# Altium schematic sheet Project_Information.SchDoc: =project_title
size Tabloid; CompanyName: Luxonis Holding; Organization: Luxonis Holding; Address1: 1925 Harmony Park Drive; Address2: Westminster, CO; Address3: 80234; Address4: United States; DocumentNumber: 1; SheetNumber: 1; SheetTotal: 2
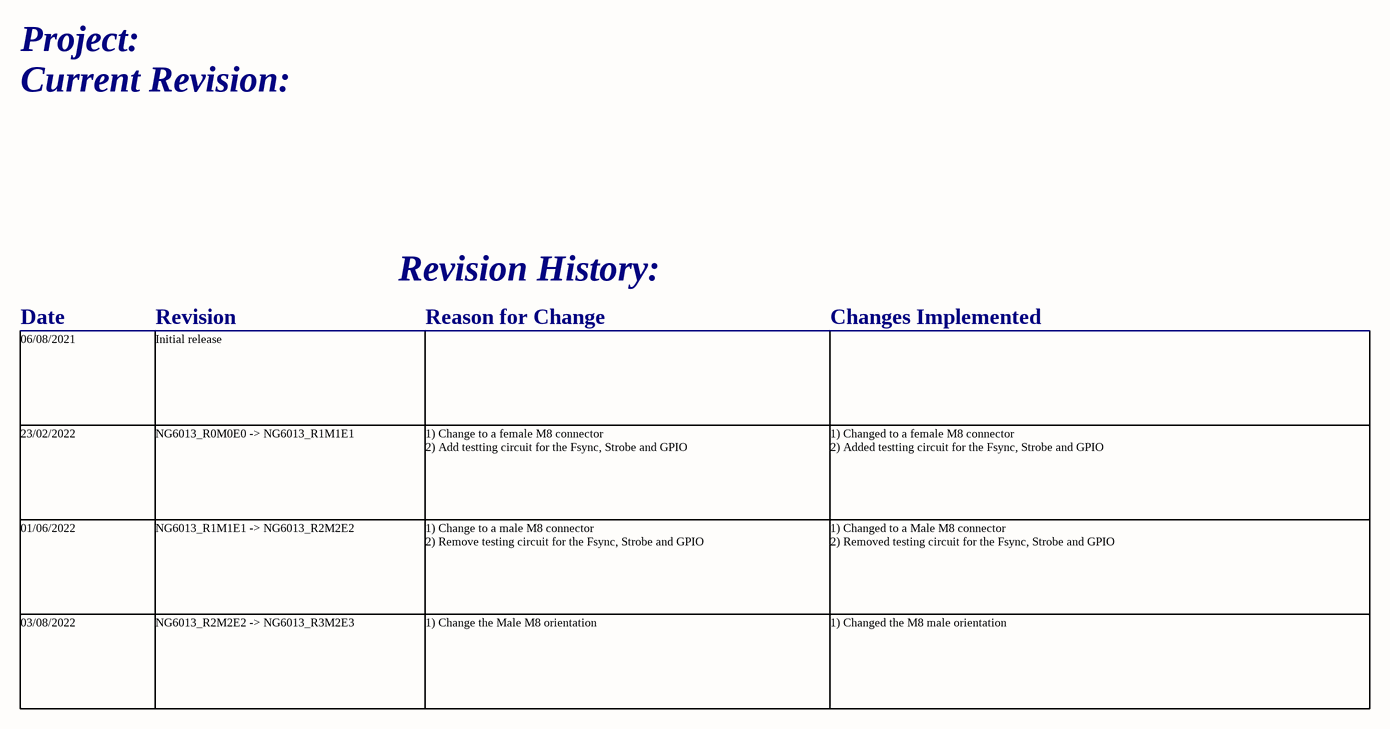
[diagram p0: Project_Information.SchDoc]

## Notes on the sheet
- Project:
- Current Revision:
- Revision History:
- Date
- Revision
- Reason for Change
- Changes Implemented
- 06/08/2021
- Initial release
- 23/02/2022
- NG6013_R0M0E0 -> NG6013_R1M1E1
- 1) Change to a female M8 connector
  2) Add testting circuit for the Fsync, Strobe and GPIO
- 1) Changed to a female M8 connector
  2) Added testting circuit for the Fsync, Strobe and GPIO
- 01/06/2022
- NG6013_R1M1E1 -> NG6013_R2M2E2
- 1) Change to a male M8 connector
  2) Remove testing circuit for the Fsync, Strobe and GPIO
- 1) Changed to a Male M8 connector
  2) Removed testing circuit for the Fsync, Strobe and GPIO
- 03/08/2022
- NG6013_R2M2E2 -> NG6013_R3M2E3
- 1) Change the Male M8 orientation
- 1) Changed the M8 male orientation
- Title
- Size:
- Date:
- Tabloid
- Number:
- Time:
- Revision:
- Sheet
- of
- Drawn by: